# Altium project Record_Player.PrjPcb
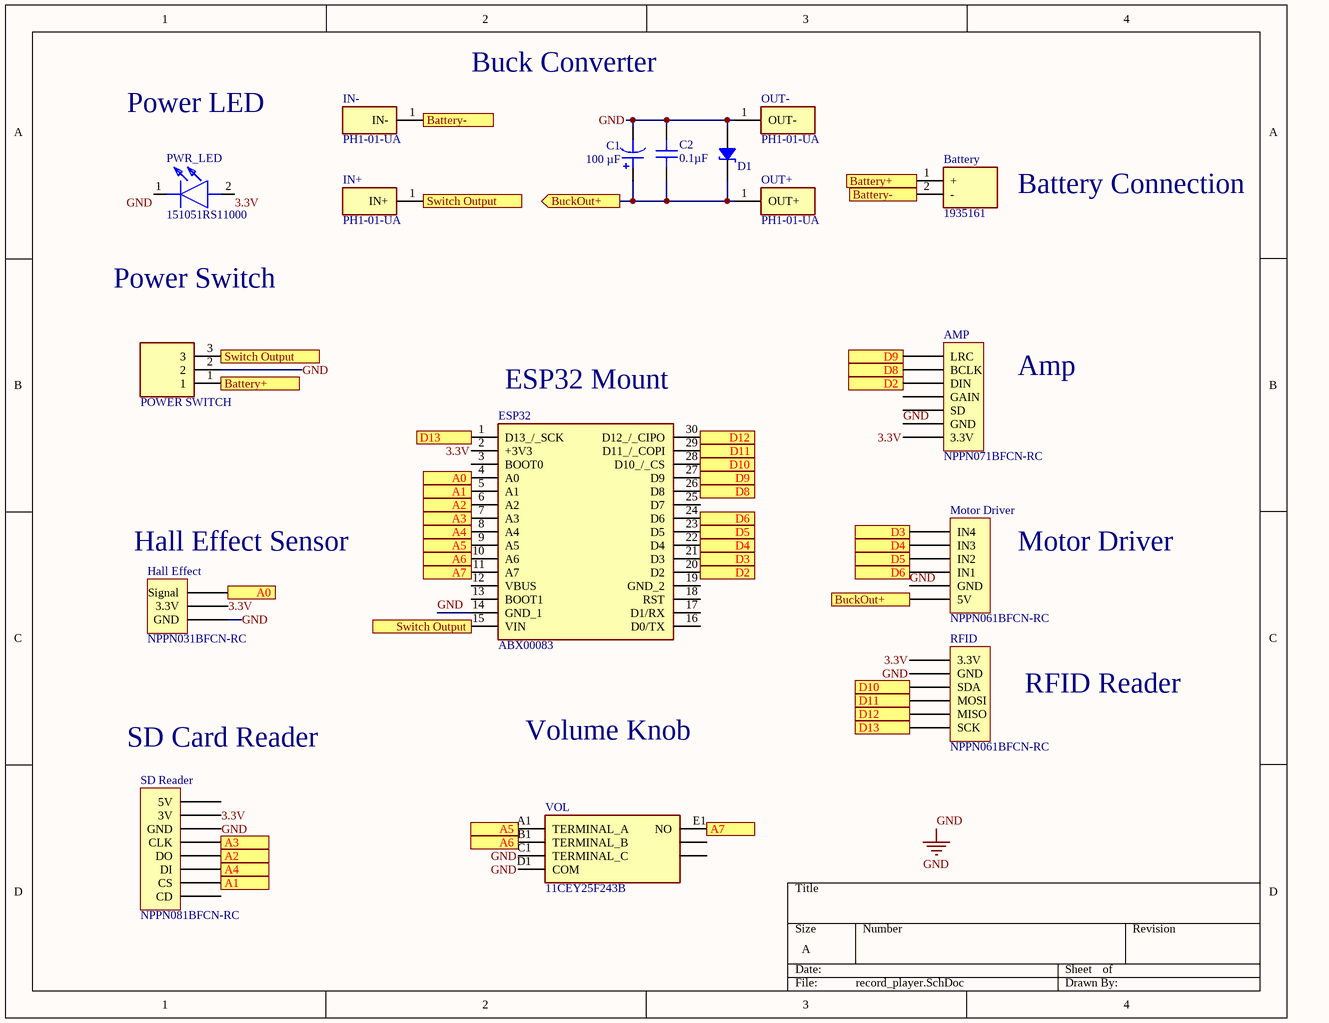
[diagram p0: record_player.SchDoc]
1 sheet, 17 parts. Net scope: flat (ports and power ports of the same name join across sheets).
Board file: record_player.PcbDoc

## Sheet record_player.SchDoc
size A; Author: Zachary Cummins; DrawnBy: Zachary Cummins; SheetNumber: 1; SheetTotal: 1

### Parts
AMP  NPPN071BFCN-RC  [SULLINS NPPN071BFCN]
Battery  1935161  [1935161]
C1  100 µF  [CAP ALSMD 5.3MM H5.4MM]
C2  0.1µF  [CAP 0805_2012]
D1  BZX84W-B6V2F  [DIODES SOT-323-3]  (value not drawn)
ESP32  ABX00083  [ABX00083]
Hall_Effect  NPPN031BFCN-RC  [SULLINS NPPN031BFCN]
IN+  PH1-01-UA  [HDRV1W64P0X254_1X1_254X250X888P]
IN-  PH1-01-UA  [HDRV1W64P0X254_1X1_254X250X888P]
Motor_Driver  NPPN061BFCN-RC  [SULLINS NPPN061BFCN]
OUT+  PH1-01-UA  [HDRV1W64P0X254_1X1_254X250X888P]
OUT-  PH1-01-UA  [HDRV1W64P0X254_1X1_254X250X888P]
POWER_SWITCH  OS102011MA1QN1  [OS102011MA1QN1]  (value not drawn)
PWR_LED  151051RS11000  [151051RS11000]
RFID  NPPN061BFCN-RC  [SULLINS NPPN061BFCN]
SD_Reader  NPPN081BFCN-RC  [SULLINS NPPN081BFCN]
VOL  11CEY25F243B  [11CEY25F243B]

### Ports
A0 (in), A0 (out), A1 (in), A1 (out), A2 (in), A2 (out), A3 (in), A3 (out), A4 (in), A4 (out), A5 (in), A5 (out), A6 (in), A6 (out), A7 (in), A7 (out), Battery+ (in), Battery+ (out), Battery- (in), Battery- (out), BuckOut+ (out), D2 (in), D2 (out), D3 (in), D3 (out), D4 (in), D4 (out), D5 (in), D5 (out), D6 (in), D6 (out), D8 (in), D8 (out), D9 (in), D9 (out), D10 (in), D10 (out), D11 (in), D11 (out), D12 (in), D12 (out), D13 (in), D13 (out), Switch Output (in), Switch Output (out)

### Nets
GND: AMP.2(GND) C1.2 C2.2 D1.1 ESP32.14(GND_1) Hall_Effect.3(GND) Motor_Driver.2(GND) OUT-.1(OUT-) POWER_SWITCH.2 PWR_LED.1(K) RFID.5(GND) SD_Reader.3(GND) VOL.C1(TERMINAL_C) VOL.D1(COM)
3.3V: AMP.1(3.3V) ESP32.2(+3V3) Hall_Effect.2(3.3V) PWR_LED.2(A) RFID.6(3.3V) SD_Reader.2(3V)
NetAMP_5: AMP.5(DIN) ESP32.20(D2) ; port D2
NetAMP_6: AMP.6(BCLK) ESP32.26(D8) ; port D8
NetAMP_7: AMP.7(LRC) ESP32.27(D9) ; port D9
NetBattery_1: Battery.1(+) POWER_SWITCH.1 ; port Battery+
NetBattery_2: Battery.2(-) IN-.1(IN-) ; port Battery-
NetC1_1: C1.1 C2.1 D1.2 Motor_Driver.1(5V) OUT+.1(OUT+) ; port BuckOut+
NetESP32_1: ESP32.1(D13_/_SCK) RFID.1(SCK) ; port D13
NetESP32_4: ESP32.4(A0) Hall_Effect.1(Signal) ; port A0
NetESP32_5: ESP32.5(A1) SD_Reader.7(CS) ; port A1
NetESP32_6: ESP32.6(A2) SD_Reader.5(DO) ; port A2
NetESP32_7: ESP32.7(A3) SD_Reader.4(CLK) ; port A3
NetESP32_8: ESP32.8(A4) SD_Reader.6(DI) ; port A4
NetESP32_9: ESP32.9(A5) VOL.A1(TERMINAL_A) ; port A5
NetESP32_10: ESP32.10(A6) VOL.B1(TERMINAL_B) ; port A6
NetESP32_11: ESP32.11(A7) VOL.E1(NO) ; port A7
NetESP32_15: ESP32.15(VIN) IN+.1(IN+) POWER_SWITCH.3 ; port Switch Output
NetESP32_21: ESP32.21(D3) Motor_Driver.6(IN4) ; port D3
NetESP32_22: ESP32.22(D4) Motor_Driver.5(IN3) ; port D4
NetESP32_23: ESP32.23(D5) Motor_Driver.4(IN2) ; port D5
NetESP32_24: ESP32.24(D6) Motor_Driver.3(IN1) ; port D6
NetESP32_28: ESP32.28(D10_/_CS) RFID.4(SDA) ; port D10
NetESP32_29: ESP32.29(D11_/_COPI) RFID.3(MOSI) ; port D11
NetESP32_30: ESP32.30(D12_/_CIPO) RFID.2(MISO) ; port D12

Not connected (* = marked no-connect by the designer): AMP 3(SD) 4(GAIN); ESP32 3(BOOT0) 12(VBUS) 13(BOOT1) 16(D0/TX) 17(D1/RX) 18(RST) 19(GND_2) 25(D7); SD_Reader 1(5V) 8(CD); VOL MH1 MH2

### Notes on the sheet
- Buck Converter
- Power LED
- Battery Connection
- Power Switch
- (near ESP32) ESP32 Mount
- Amp
- (near Hall_Effect) Hall Effect Sensor
- Motor Driver
- RFID Reader
- (near SD_Reader) SD Card Reader
- Volume Knob

### Library data of the parts
AMP = NPPN071BFCN-RC: CONN HDR 7POS 0.079 GOLD PCB; Manufacturer: Sullins Connector Solutions; Connector Type: Header; Contact Length - Post: 0.094" (2.40mm); Current Rating (Amps): 2A; Material Flammability Rating: UL94 V-0; Number of Positions: 7; Number of Positions Loaded: All; Pitch - Mating: 0.079" (2.00mm); Style: Board to Board; Part Number: NPPN071BFCN-RC; ComponentLink1Description: Datasheet; ComponentLink1URL: https://drawings-pdf.s3.amazonaws.com/10483.pdf; ComponentLink2Description: DigiKey Link; ComponentLink2URL: https://www.digikey.com/en/products/detail/sullins-connector-solutions/NPPN071BFCN-RC/804809; Contact Finish - Mating: Gold; Contact Finish - Post: Gold; Contact Finish Thickness - Mating: Flash; Contact Type: Female Socket; Fastening Type: Push-Pull; Insulation Color: Black; Insulation Height: 0.173" (4.40mm); LastUpdated: 6/21/2022 2:43:39 PM; Lifecycle Status: Active; Minimum Order: 1; Mounting Type: Through Hole; Number of Rows: 1; Operating Temperature: -40°C ~ 105°C; Packaging: Tube; Part Status: Active; Price: 0.42; Series: -; Supplier 1: DigiKey; Supplier Part Number 1: S5751-07-ND; Termination: Solder
Battery = 1935161: Connector; Manufacturer_Name: Phoenix Contact; Datasheet Link: https://www.phoenixcontact.com/en-us/products/printed-circuit-board-terminal-pt-15-2-50-h-1935161?type=pdf; Height: 11.55mm; Manufacturer_Part_Number: 1935161; Mouser Part Number: 651-1935161; Mouser Price/Stock: https://www.mouser.co.uk/ProductDetail/Phoenix-Contact/1935161?qs=W3wJikR1%252BS6eKzfFl8Rbew%3D%3D; Arrow Part Number: 1935161; Arrow Price/Stock: https://www.arrow.com/en/products/1935161/phoenix-contact?utm_currency=USD&region=nac
C1 = 865090142005: CAP ALUM 100UF 20% 6.3V SMD; manufacturer: Würth Elektronik; Lifetime @ Temp.: 1000 Hrs @ 85°C; Polarization: Polar; Ripple Current @ High Frequency: 105 mA @ 100 kHz; Ripple Current @ Low Frequency: 70 mA @ 120 Hz; Surface Mount Land Size: 0.209" L x 0.209" W (5.30mm x 5.30mm); Part Number: 865090142005; Applications: General Purpose; Capacitance: 100 µF; componentlink1description: Datasheet; componentlink1url: https://katalog.we-online.de/pbs/datasheet/865090142005.pdf; componentlink2description: DigiKey Link; componentlink2url: https://www.digikey.com/en/products/detail/würth-elektronik/865090142005/5727984; Device Package: Radial, Can - SMD; Height - Seated (Max): 0.217" (5.50mm); lastupdated: 4/5/2026 8:30:07 PM; Lifecycle Status: Active; Minimum Order: 1; Mounting Type: Surface Mount; Operating Temperature: -40°C ~ 85°C; Package / Case: Radial, Can - SMD; packaging: TapeAndReel; partid: 7916; Part Status: Active; price: 0.13; series: WCAP-ASLU; Size / Dimension: 0.197" Dia (5.00mm); Supplier 1: DigiKey; Supplier Part Number 1: 732-8389-1-ND; Tolerance: ±20%; value: 100 µF; Voltage - Rated: 6.3 V
C2 = 08056C104JAZ2A: CAP CER 0.1UF 6.3V X7R 0805; manufacturer: AVX Corporation; Tolerance: ±5%; Part Number: 08056C104JAZ2A; Capacitance: 0.1µF; Applications: Boardflex Sensitive; componentlink1description: Datasheet; componentlink1url: http://datasheets.avx.com/FlexitermMLCC.pdf; componentlink2description: DigiKey Link; componentlink2url: http://digikey.com/product-detail/en/avx-corporation/08056C104JAZ2A/478-11914-1-ND/8573550; Device Package: 0805 (2012 Metric); Features: Soft Termination; lastupdated: 9/2/2020 1:04:11 AM; Lifecycle Status: Active; Minimum Order: 1; Mounting Type: Surface Mount, MLCC; Operating Temperature: -55°C ~ 125°C; Package / Case: 0805 (2012 Metric); packaging: TapeAndReel; partid: 16783; Part Status: Active; price: 0.08; series: FLEXITERM®; Size / Dimension: 0.079" L x 0.049" W (2.01mm x 1.25mm); Supplier 1: DigiKey; Supplier Part Number 1: 478-11914-1-ND; Temperature Coefficient: X7R; value: 0.1µF; Voltage - Rated: 6.3V
D1 = BZX84W-B6V2F: DIODE ZENER 6.2V 275MW SOT323; Manufacturer: Nexperia USA Inc.; Current - Reverse Leakage @ Vr: 3 µA @ 4 V; Impedance (Max) (Zzt): 10 Ohms; Tolerance: ±2%; Voltage - Forward (Vf) (Max) @ If: 900 mV @ 10 mA; Part Number: BZX84W-B6V2F; ComponentLink1Description: Datasheet; ComponentLink1URL: https://assets.nexperia.com/documents/data-sheet/BZX84W_SER.pdf; ComponentLink2Description: DigiKey Link; ComponentLink2URL: https://www.digikey.com/en/products/detail/nexperia-usa-inc/BZX84W-B6V2F/9380695; LastUpdated: 4/5/2026 8:40:51 PM; Lifecycle Status: Active; Minimum Order: 1; Mounting Type: Surface Mount; Operating Temperature: 150°C (TJ); Package / Case: SC-70, SOT-323; Packaging: TapeAndReel; PartId: 809; Part Status: Active; Power - Max: 275 mW; Price: 0.02; Series: BZX84W; Supplier 1: DigiKey; Supplier Part Number 1: 1727-8280-1-ND; Supplier Device Package: SOT-323; Voltage - Zener (Nom) (Vz): 6.2 V
ESP32 = ABX00083: Integrated Circuit; Manufacturer_Name: Arduino; Datasheet Link: https://docs.arduino.cc/resources/datasheets/ABX00083-datasheet.pdf; Manufacturer_Part_Number: ABX00083; Mouser Part Number: 782-ABX00083; Mouser Price/Stock: https://www.mouser.co.uk/ProductDetail/Arduino/ABX00083?qs=ulEaXIWI0c8OkA6u7pnNRA%3D%3D; Arrow Part Number: ABX00083; Arrow Price/Stock: https://www.arrow.com/en/products/abx00083/arduino-corporation.html?utm_currency=USD&region=nac
Hall_Effect = NPPN031BFCN-RC: CONN HDR 3POS 0.079 GOLD PCB; Manufacturer: Sullins Connector Solutions; Connector Type: Header; Contact Length - Post: 0.094" (2.40mm); Current Rating (Amps): 2A; Material Flammability Rating: UL94 V-0; Number of Positions: 3; Number of Positions Loaded: All; Pitch - Mating: 0.079" (2.00mm); Style: Board to Board; Part Number: NPPN031BFCN-RC; ComponentLink1Description: Datasheet; ComponentLink1URL: https://drawings-pdf.s3.amazonaws.com/10483.pdf; ComponentLink2Description: DigiKey Link; ComponentLink2URL: https://www.digikey.com/en/products/detail/sullins-connector-solutions/NPPN031BFCN-RC/804805; Contact Finish - Mating: Gold; Contact Finish - Post: Gold; Contact Finish Thickness - Mating: Flash; Contact Type: Female Socket; Fastening Type: Push-Pull; Insulation Color: Black; Insulation Height: 0.173" (4.40mm); LastUpdated: 6/21/2022 2:42:20 PM; Lifecycle Status: Active; Minimum Order: 1; Mounting Type: Through Hole; Number of Rows: 1; Operating Temperature: -40°C ~ 105°C; Packaging: Tube; Part Status: Active; Price: 0.25; Series: -; Supplier 1: DigiKey; Supplier Part Number 1: S5751-03-ND; Termination: Solder
IN+ IN- OUT+ OUT- = PH1-01-UA: Connector; Manufacturer_Name: Adam Tech; Datasheet Link: https://app.adam-tech.com/products/download/data_sheet/201605/ph1-xx-ua-data-sheet.pdf; Height: 8.881mm; Manufacturer_Part_Number: PH1-01-UA; Mouser Part Number: 737-PH1-01-UA; Mouser Price/Stock: https://www.mouser.co.uk/ProductDetail/Adam-Tech/PH1-01-UA?qs=HoCaDK9Nz5d5oFPj3mhtaw%3D%3D; Arrow Part Number: PH1-01-UA; Arrow Price/Stock: https://www.arrow.com/en/products/ph1-01-ua/adam-tech?utm_currency=USD&region=nac
Motor_Driver RFID = NPPN061BFCN-RC: CONN HDR 6POS 0.079 GOLD PCB; Manufacturer: Sullins Connector Solutions; Connector Type: Header; Contact Length - Post: 0.094" (2.40mm); Current Rating (Amps): 2A; Material Flammability Rating: UL94 V-0; Number of Positions: 6; Number of Positions Loaded: All; Pitch - Mating: 0.079" (2.00mm); Style: Board to Board; Part Number: NPPN061BFCN-RC; ComponentLink1Description: Datasheet; ComponentLink1URL: https://drawings-pdf.s3.amazonaws.com/10483.pdf; ComponentLink2Description: DigiKey Link; ComponentLink2URL: https://www.digikey.com/en/products/detail/sullins-connector-solutions/NPPN061BFCN-RC/804808; Contact Finish - Mating: Gold; Contact Finish - Post: Gold; Contact Finish Thickness - Mating: Flash; Contact Type: Female Socket; Fastening Type: Push-Pull; Insulation Color: Black; Insulation Height: 0.173" (4.40mm); LastUpdated: 6/21/2022 2:43:22 PM; Lifecycle Status: Active; Minimum Order: 1; Mounting Type: Through Hole; Number of Rows: 1; Operating Temperature: -40°C ~ 105°C; Packaging: Tube; Part Status: Active; Price: 0.40; Series: -; Supplier 1: DigiKey; Supplier Part Number 1: S5751-06-ND; Termination: Solder
POWER_SWITCH = OS102011MA1QN1: Switch; Manufacturer_Name: LITTELFUSE; Datasheet Link: https://www.ckswitches.com/media/1428/os.pdf; Manufacturer_Part_Number: OS102011MA1QN1; Mouser Part Number: 611-OS102011MA1QN1; Mouser Price/Stock: https://www.mouser.co.uk/ProductDetail/CK/OS102011MA1QN1?qs=WtljUlYws5R6MUgHcLkz4w%3D%3D; Arrow Part Number: OS102011MA1QN1; Arrow Price/Stock: https://www.arrow.com/en/products/os102011ma1qn1/ck?utm_currency=USD&region=nac
PWR_LED = 151051RS11000: LED; Manufacturer_Name: Wurth Elektronik; Datasheet Link: https://www.we-online.com/catalog/datasheet/151051RS11000.pdf; Height: 8.6mm; Manufacturer_Part_Number: 151051RS11000; Mouser Part Number: 710-151051RS11000; Mouser Price/Stock: https://www.mouser.co.uk/ProductDetail/Wurth-Elektronik/151051RS11000?qs=LlUlMxKIyB0NuMCRBgVmEg%3D%3D
SD_Reader = NPPN081BFCN-RC: CONN HDR 8POS 0.079 GOLD PCB; Manufacturer: Sullins Connector Solutions; Connector Type: Header; Contact Length - Post: 0.094" (2.40mm); Current Rating (Amps): 2A; Material Flammability Rating: UL94 V-0; Number of Positions: 8; Number of Positions Loaded: All; Pitch - Mating: 0.079" (2.00mm); Style: Board to Board; Part Number: NPPN081BFCN-RC; ComponentLink1Description: Datasheet; ComponentLink1URL: https://drawings-pdf.s3.amazonaws.com/10483.pdf; ComponentLink2Description: DigiKey Link; ComponentLink2URL: https://www.digikey.com/en/products/detail/sullins-connector-solutions/NPPN081BFCN-RC/804810; Contact Finish - Mating: Gold; Contact Finish - Post: Gold; Contact Finish Thickness - Mating: Flash; Contact Type: Female Socket; Fastening Type: Push-Pull; Insulation Color: Black; Insulation Height: 0.173" (4.40mm); LastUpdated: 6/21/2022 2:43:53 PM; Lifecycle Status: Active; Minimum Order: 1; Mounting Type: Through Hole; Number of Rows: 1; Operating Temperature: -40°C ~ 105°C; Packaging: Tube; Part Status: Active; Price: 0.44; Series: -; Supplier 1: DigiKey; Supplier Part Number 1: S5751-08-ND; Termination: Solder
VOL = 11CEY25F243B: Variable Resistor; Manufacturer_Name: CTS; Datasheet Link: https://www.ctscorp.com/wp-content/uploads/Series-11CE-Data-Sheet-Rev-B.pdf; Height: 17.1mm; Manufacturer_Part_Number: 11CEY25F243B